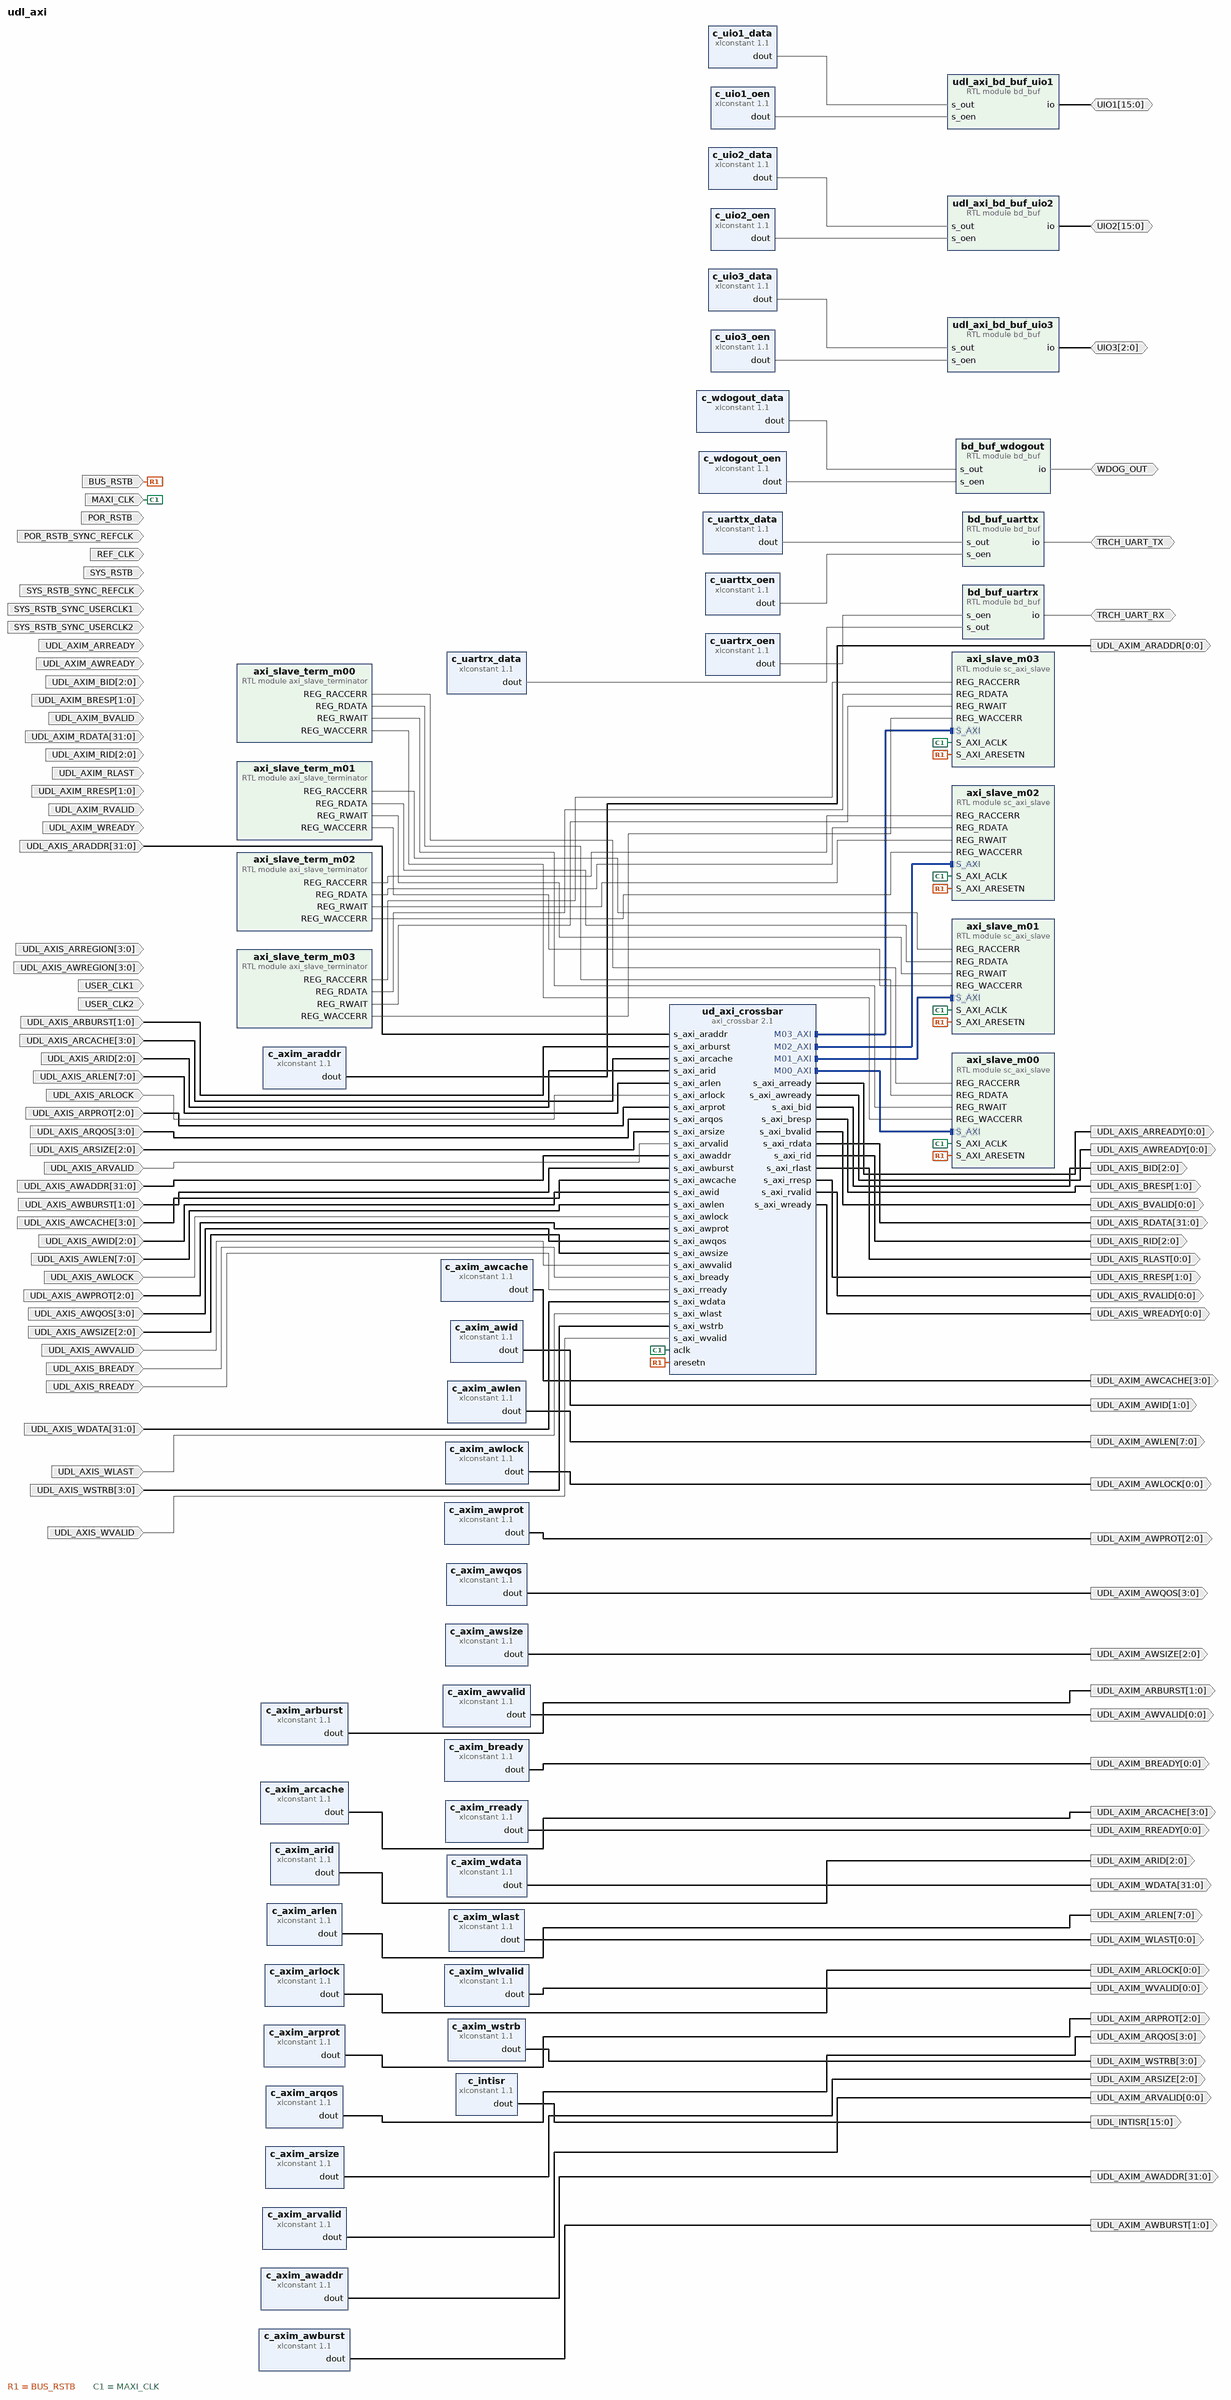
[diagram p0: block diagram of the top level]
# Vivado block design udl_axi, xc7a200tfbg676-1, Vivado 2022.2
create_bd_design udl_axi

create_bd_port -dir I -type clk MAXI_CLK
set_property -dict {CONFIG.FREQ_HZ 48000000} [get_bd_ports MAXI_CLK]
create_bd_port -dir I -type clk REF_CLK
set_property -dict {CONFIG.FREQ_HZ 24000000} [get_bd_ports REF_CLK]
create_bd_port -dir I -type clk USER_CLK2
set_property -dict {CONFIG.FREQ_HZ 24000000} [get_bd_ports USER_CLK2]
create_bd_port -dir I -type rst SYS_RSTB_SYNC_REFCLK
create_bd_port -dir I -type rst SYS_RSTB_SYNC_USERCLK1
create_bd_port -dir I -type rst SYS_RSTB_SYNC_USERCLK2
create_bd_port -dir I -type rst SYS_RSTB
create_bd_port -dir I -type rst POR_RSTB
create_bd_port -dir I -type rst POR_RSTB_SYNC_REFCLK
create_bd_port -dir I -type rst BUS_RSTB
create_bd_port -dir O -from 15 -to 0 -type intr UDL_INTISR
create_bd_port -dir O -from 1 -to 0 -type data UDL_AXIM_AWID
create_bd_port -dir O -from 0 -to 0 -type data UDL_AXIM_AWLOCK
create_bd_port -dir IO -from 15 -to 0 -type data UIO1
create_bd_port -dir O -from 31 -to 0 -type data UDL_AXIM_AWADDR
create_bd_port -dir O -from 7 -to 0 -type data UDL_AXIM_AWLEN
create_bd_port -dir O -from 2 -to 0 -type data UDL_AXIM_AWSIZE
create_bd_port -dir O -from 1 -to 0 -type data UDL_AXIM_AWBURST
create_bd_port -dir O -from 3 -to 0 -type data UDL_AXIM_AWCACHE
create_bd_port -dir O -from 2 -to 0 -type data UDL_AXIM_AWPROT
create_bd_port -dir O -from 3 -to 0 -type data UDL_AXIM_AWQOS
create_bd_port -dir O -from 0 -to 0 -type data UDL_AXIM_AWVALID
create_bd_port -dir I -type data UDL_AXIM_AWREADY
create_bd_port -dir O -from 31 -to 0 -type data UDL_AXIM_WDATA
create_bd_port -dir O -from 3 -to 0 -type data UDL_AXIM_WSTRB
create_bd_port -dir O -from 0 -to 0 -type data UDL_AXIM_WLAST
create_bd_port -dir O -from 0 -to 0 -type data UDL_AXIM_WVALID
create_bd_port -dir I -type data UDL_AXIM_WREADY
create_bd_port -dir I -from 2 -to 0 -type data UDL_AXIM_BID
create_bd_port -dir I -from 1 -to 0 -type data UDL_AXIM_BRESP
create_bd_port -dir I -type data UDL_AXIM_BVALID
create_bd_port -dir O -from 0 -to 0 -type data UDL_AXIM_BREADY
create_bd_port -dir O -from 2 -to 0 -type data UDL_AXIM_ARID
create_bd_port -dir O -from 0 -to 0 -type data UDL_AXIM_ARADDR
create_bd_port -dir O -from 7 -to 0 -type data UDL_AXIM_ARLEN
create_bd_port -dir O -from 2 -to 0 -type data UDL_AXIM_ARSIZE
create_bd_port -dir O -from 1 -to 0 -type data UDL_AXIM_ARBURST
create_bd_port -dir O -from 0 -to 0 -type data UDL_AXIM_ARLOCK
create_bd_port -dir O -from 3 -to 0 -type data UDL_AXIM_ARCACHE
create_bd_port -dir O -from 2 -to 0 -type data UDL_AXIM_ARPROT
create_bd_port -dir O -from 3 -to 0 -type data UDL_AXIM_ARQOS
create_bd_port -dir O -from 0 -to 0 -type data UDL_AXIM_ARVALID
create_bd_port -dir I -type data UDL_AXIM_ARREADY
create_bd_port -dir I -from 2 -to 0 -type data UDL_AXIM_RID
create_bd_port -dir I -from 31 -to 0 -type data UDL_AXIM_RDATA
create_bd_port -dir I -type data UDL_AXIM_RLAST
create_bd_port -dir I -type data UDL_AXIM_RVALID
create_bd_port -dir O -from 0 -to 0 -type data UDL_AXIM_RREADY
create_bd_port -dir I -from 2 -to 0 -type data UDL_AXIS_AWID
create_bd_port -dir I -from 31 -to 0 -type data UDL_AXIS_AWADDR
create_bd_port -dir I -from 7 -to 0 -type data UDL_AXIS_AWLEN
create_bd_port -dir I -from 2 -to 0 -type data UDL_AXIS_AWSIZE
create_bd_port -dir I -from 1 -to 0 -type data UDL_AXIS_AWBURST
create_bd_port -dir I -from 3 -to 0 -type data UDL_AXIS_AWCACHE
create_bd_port -dir I -from 2 -to 0 -type data UDL_AXIS_AWPROT
create_bd_port -dir I -from 3 -to 0 -type data UDL_AXIS_AWREGION
create_bd_port -dir I -from 3 -to 0 -type data UDL_AXIS_AWQOS
create_bd_port -dir I -type data UDL_AXIS_AWVALID
create_bd_port -dir O -from 0 -to 0 -type data UDL_AXIS_AWREADY
create_bd_port -dir I -from 31 -to 0 -type data UDL_AXIS_WDATA
create_bd_port -dir I -from 3 -to 0 -type data UDL_AXIS_WSTRB
create_bd_port -dir I -type data UDL_AXIS_WLAST
create_bd_port -dir I -type data UDL_AXIS_WVALID
create_bd_port -dir O -from 0 -to 0 -type data UDL_AXIS_WREADY
create_bd_port -dir O -from 2 -to 0 -type data UDL_AXIS_BID
create_bd_port -dir O -from 1 -to 0 -type data UDL_AXIS_BRESP
create_bd_port -dir O -from 0 -to 0 -type data UDL_AXIS_BVALID
create_bd_port -dir I -type data UDL_AXIS_BREADY
create_bd_port -dir I -from 2 -to 0 -type data UDL_AXIS_ARID
create_bd_port -dir I -from 31 -to 0 -type data UDL_AXIS_ARADDR
create_bd_port -dir I -from 7 -to 0 -type data UDL_AXIS_ARLEN
create_bd_port -dir I -from 2 -to 0 -type data UDL_AXIS_ARSIZE
create_bd_port -dir I -from 1 -to 0 -type data UDL_AXIS_ARBURST
create_bd_port -dir I -type data UDL_AXIS_ARLOCK
create_bd_port -dir I -from 3 -to 0 -type data UDL_AXIS_ARCACHE
create_bd_port -dir I -from 2 -to 0 -type data UDL_AXIS_ARPROT
create_bd_port -dir I -from 3 -to 0 -type data UDL_AXIS_ARREGION
create_bd_port -dir I -from 3 -to 0 -type data UDL_AXIS_ARQOS
create_bd_port -dir I -type data UDL_AXIS_ARVALID
create_bd_port -dir O -from 0 -to 0 -type data UDL_AXIS_ARREADY
create_bd_port -dir O -from 2 -to 0 -type data UDL_AXIS_RID
create_bd_port -dir O -from 31 -to 0 -type data UDL_AXIS_RDATA
create_bd_port -dir O -from 1 -to 0 -type data UDL_AXIS_RRESP
create_bd_port -dir O -from 0 -to 0 -type data UDL_AXIS_RLAST
create_bd_port -dir O -from 0 -to 0 -type data UDL_AXIS_RVALID
create_bd_port -dir I -type data UDL_AXIS_RREADY
create_bd_port -dir IO -from 15 -to 0 -type data UIO2
create_bd_port -dir IO -from 2 -to 0 -type data UIO3
create_bd_port -dir IO -type data TRCH_UART_TX
create_bd_port -dir IO -type data TRCH_UART_RX
create_bd_port -dir IO -type data WDOG_OUT
create_bd_port -dir I -type clk USER_CLK1
set_property -dict {CONFIG.FREQ_HZ 24000000} [get_bd_ports USER_CLK1]
create_bd_port -dir I -from 1 -to 0 -type data UDL_AXIM_RRESP
create_bd_port -dir I -type data UDL_AXIS_AWLOCK

create_bd_cell -type ip -vlnv xilinx.com:ip:axi_crossbar:2.1 ud_axi_crossbar
set_property -dict [list \
  CONFIG.ID_WIDTH 3 \
  CONFIG.M00_A00_ADDR_WIDTH 16 \
  CONFIG.M00_A00_BASE_ADDR 0x0000000050000000 \
  CONFIG.M01_A00_ADDR_WIDTH 16 \
  CONFIG.M01_A00_BASE_ADDR 0x0000000050010000 \
  CONFIG.M02_A00_ADDR_WIDTH 16 \
  CONFIG.M02_A00_BASE_ADDR 0x0000000050020000 \
  CONFIG.M03_A00_ADDR_WIDTH 16 \
  CONFIG.M03_A00_BASE_ADDR 0x0000000050030000 \
  CONFIG.NUM_MI 4 \
  CONFIG.S00_ARB_PRIORITY 0 \
] [get_bd_cells ud_axi_crossbar]
create_bd_cell -type ip -vlnv xilinx.com:ip:xlconstant:1.1 c_uio1_oen
set_property -dict {CONFIG.CONST_VAL 0x0000 CONFIG.CONST_WIDTH 16} [get_bd_cells c_uio1_oen]
create_bd_cell -type ip -vlnv xilinx.com:ip:xlconstant:1.1 c_uio1_data
set_property -dict {CONFIG.CONST_VAL 0x0000 CONFIG.CONST_WIDTH 16} [get_bd_cells c_uio1_data]
create_bd_cell -type ip -vlnv xilinx.com:ip:xlconstant:1.1 c_uio2_oen
set_property -dict {CONFIG.CONST_VAL 0x0000 CONFIG.CONST_WIDTH 16} [get_bd_cells c_uio2_oen]
create_bd_cell -type ip -vlnv xilinx.com:ip:xlconstant:1.1 c_uio2_data
set_property -dict {CONFIG.CONST_VAL 0x0000 CONFIG.CONST_WIDTH 16} [get_bd_cells c_uio2_data]
create_bd_cell -type ip -vlnv xilinx.com:ip:xlconstant:1.1 c_uio3_oen
set_property -dict {CONFIG.CONST_VAL 0x0 CONFIG.CONST_WIDTH 3} [get_bd_cells c_uio3_oen]
create_bd_cell -type ip -vlnv xilinx.com:ip:xlconstant:1.1 c_uio3_data
set_property -dict {CONFIG.CONST_VAL 0x0 CONFIG.CONST_WIDTH 3} [get_bd_cells c_uio3_data]
create_bd_cell -type ip -vlnv xilinx.com:ip:xlconstant:1.1 c_uarttx_oen
create_bd_cell -type ip -vlnv xilinx.com:ip:xlconstant:1.1 c_uarttx_data
create_bd_cell -type ip -vlnv xilinx.com:ip:xlconstant:1.1 c_uartrx_oen
create_bd_cell -type ip -vlnv xilinx.com:ip:xlconstant:1.1 c_uartrx_data
create_bd_cell -type ip -vlnv xilinx.com:ip:xlconstant:1.1 c_wdogout_oen
create_bd_cell -type ip -vlnv xilinx.com:ip:xlconstant:1.1 c_wdogout_data
create_bd_cell -type module -reference sc_axi_slave axi_slave_m01
create_bd_cell -type module -reference sc_axi_slave axi_slave_m02
create_bd_cell -type module -reference sc_axi_slave axi_slave_m03
create_bd_cell -type ip -vlnv xilinx.com:ip:xlconstant:1.1 c_intisr
set_property -dict {CONFIG.CONST_VAL 0x0000 CONFIG.CONST_WIDTH 16} [get_bd_cells c_intisr]
create_bd_cell -type module -reference sc_axi_slave axi_slave_m00
create_bd_cell -type module -reference axi_slave_terminator axi_slave_term_m00
create_bd_cell -type module -reference axi_slave_terminator axi_slave_term_m01
create_bd_cell -type module -reference axi_slave_terminator axi_slave_term_m02
create_bd_cell -type module -reference axi_slave_terminator axi_slave_term_m03
create_bd_cell -type module -reference bd_buf bd_buf_uartrx
set_property -dict {CONFIG.BUS_WIDTH 1} [get_bd_cells bd_buf_uartrx]
create_bd_cell -type module -reference bd_buf bd_buf_uarttx
set_property -dict {CONFIG.BUS_WIDTH 1} [get_bd_cells bd_buf_uarttx]
create_bd_cell -type module -reference bd_buf bd_buf_wdogout
set_property -dict {CONFIG.BUS_WIDTH 1} [get_bd_cells bd_buf_wdogout]
create_bd_cell -type module -reference bd_buf udl_axi_bd_buf_uio1
create_bd_cell -type module -reference bd_buf udl_axi_bd_buf_uio2
create_bd_cell -type module -reference bd_buf udl_axi_bd_buf_uio3
set_property -dict {CONFIG.BUS_WIDTH 3} [get_bd_cells udl_axi_bd_buf_uio3]
create_bd_cell -type ip -vlnv xilinx.com:ip:xlconstant:1.1 c_axim_awid
set_property -dict {CONFIG.CONST_VAL 0b00 CONFIG.CONST_WIDTH 2} [get_bd_cells c_axim_awid]
create_bd_cell -type ip -vlnv xilinx.com:ip:xlconstant:1.1 c_axim_awaddr
set_property -dict {CONFIG.CONST_VAL 0x00000000 CONFIG.CONST_WIDTH 32} [get_bd_cells c_axim_awaddr]
create_bd_cell -type ip -vlnv xilinx.com:ip:xlconstant:1.1 c_axim_awlen
set_property -dict {CONFIG.CONST_VAL 0x00 CONFIG.CONST_WIDTH 8} [get_bd_cells c_axim_awlen]
create_bd_cell -type ip -vlnv xilinx.com:ip:xlconstant:1.1 c_axim_awsize
set_property -dict {CONFIG.CONST_VAL 0x0 CONFIG.CONST_WIDTH 3} [get_bd_cells c_axim_awsize]
create_bd_cell -type ip -vlnv xilinx.com:ip:xlconstant:1.1 c_axim_awburst
set_property -dict {CONFIG.CONST_VAL 0b00 CONFIG.CONST_WIDTH 2} [get_bd_cells c_axim_awburst]
create_bd_cell -type ip -vlnv xilinx.com:ip:xlconstant:1.1 c_axim_awlock
set_property -dict {CONFIG.CONST_VAL 0} [get_bd_cells c_axim_awlock]
create_bd_cell -type ip -vlnv xilinx.com:ip:xlconstant:1.1 c_axim_awcache
set_property -dict {CONFIG.CONST_VAL 0x0 CONFIG.CONST_WIDTH 4} [get_bd_cells c_axim_awcache]
create_bd_cell -type ip -vlnv xilinx.com:ip:xlconstant:1.1 c_axim_awprot
set_property -dict {CONFIG.CONST_VAL 0x0 CONFIG.CONST_WIDTH 3} [get_bd_cells c_axim_awprot]
create_bd_cell -type ip -vlnv xilinx.com:ip:xlconstant:1.1 c_axim_awqos
set_property -dict {CONFIG.CONST_VAL 0x0 CONFIG.CONST_WIDTH 4} [get_bd_cells c_axim_awqos]
create_bd_cell -type ip -vlnv xilinx.com:ip:xlconstant:1.1 c_axim_awvalid
set_property -dict {CONFIG.CONST_VAL 0} [get_bd_cells c_axim_awvalid]
create_bd_cell -type ip -vlnv xilinx.com:ip:xlconstant:1.1 c_axim_wdata
set_property -dict {CONFIG.CONST_VAL 0x00000000 CONFIG.CONST_WIDTH 32} [get_bd_cells c_axim_wdata]
create_bd_cell -type ip -vlnv xilinx.com:ip:xlconstant:1.1 c_axim_wstrb
set_property -dict {CONFIG.CONST_VAL 0x0 CONFIG.CONST_WIDTH 4} [get_bd_cells c_axim_wstrb]
create_bd_cell -type ip -vlnv xilinx.com:ip:xlconstant:1.1 c_axim_wlast
set_property -dict {CONFIG.CONST_VAL 0} [get_bd_cells c_axim_wlast]
create_bd_cell -type ip -vlnv xilinx.com:ip:xlconstant:1.1 c_axim_wlvalid
create_bd_cell -type ip -vlnv xilinx.com:ip:xlconstant:1.1 c_axim_bready
create_bd_cell -type ip -vlnv xilinx.com:ip:xlconstant:1.1 c_axim_arid
set_property -dict {CONFIG.CONST_VAL 0x0 CONFIG.CONST_WIDTH 3} [get_bd_cells c_axim_arid]
create_bd_cell -type ip -vlnv xilinx.com:ip:xlconstant:1.1 c_axim_araddr
create_bd_cell -type ip -vlnv xilinx.com:ip:xlconstant:1.1 c_axim_arlen
set_property -dict {CONFIG.CONST_VAL 0x00 CONFIG.CONST_WIDTH 8} [get_bd_cells c_axim_arlen]
create_bd_cell -type ip -vlnv xilinx.com:ip:xlconstant:1.1 c_axim_arsize
set_property -dict {CONFIG.CONST_VAL 0x0 CONFIG.CONST_WIDTH 3} [get_bd_cells c_axim_arsize]
create_bd_cell -type ip -vlnv xilinx.com:ip:xlconstant:1.1 c_axim_arburst
set_property -dict {CONFIG.CONST_VAL 0b00 CONFIG.CONST_WIDTH 2} [get_bd_cells c_axim_arburst]
create_bd_cell -type ip -vlnv xilinx.com:ip:xlconstant:1.1 c_axim_arlock
set_property -dict {CONFIG.CONST_VAL 0} [get_bd_cells c_axim_arlock]
create_bd_cell -type ip -vlnv xilinx.com:ip:xlconstant:1.1 c_axim_arcache
set_property -dict {CONFIG.CONST_VAL 0x0 CONFIG.CONST_WIDTH 4} [get_bd_cells c_axim_arcache]
create_bd_cell -type ip -vlnv xilinx.com:ip:xlconstant:1.1 c_axim_arqos
set_property -dict {CONFIG.CONST_VAL 0x0 CONFIG.CONST_WIDTH 4} [get_bd_cells c_axim_arqos]
create_bd_cell -type ip -vlnv xilinx.com:ip:xlconstant:1.1 c_axim_arprot
set_property -dict {CONFIG.CONST_VAL 0x0 CONFIG.CONST_WIDTH 3} [get_bd_cells c_axim_arprot]
create_bd_cell -type ip -vlnv xilinx.com:ip:xlconstant:1.1 c_axim_arvalid
set_property -dict {CONFIG.CONST_VAL 0} [get_bd_cells c_axim_arvalid]
create_bd_cell -type ip -vlnv xilinx.com:ip:xlconstant:1.1 c_axim_rready

# ---- connections ----

connect_bd_intf_net [get_bd_intf_pins axi_slave_m00/S_AXI] [get_bd_intf_pins ud_axi_crossbar/M00_AXI]
connect_bd_intf_net [get_bd_intf_pins axi_slave_m01/S_AXI] [get_bd_intf_pins ud_axi_crossbar/M01_AXI]
connect_bd_intf_net [get_bd_intf_pins axi_slave_m02/S_AXI] [get_bd_intf_pins ud_axi_crossbar/M02_AXI]
connect_bd_intf_net [get_bd_intf_pins axi_slave_m03/S_AXI] [get_bd_intf_pins ud_axi_crossbar/M03_AXI]
connect_bd_net [get_bd_ports BUS_RSTB] \
  [get_bd_pins ud_axi_crossbar/aresetn] [get_bd_pins axi_slave_m00/S_AXI_ARESETN] [get_bd_pins axi_slave_m01/S_AXI_ARESETN] \
  [get_bd_pins axi_slave_m02/S_AXI_ARESETN] [get_bd_pins axi_slave_m03/S_AXI_ARESETN]
connect_bd_net [get_bd_ports MAXI_CLK] \
  [get_bd_pins ud_axi_crossbar/aclk] [get_bd_pins axi_slave_m00/S_AXI_ACLK] [get_bd_pins axi_slave_m01/S_AXI_ACLK] \
  [get_bd_pins axi_slave_m02/S_AXI_ACLK] [get_bd_pins axi_slave_m03/S_AXI_ACLK]
connect_bd_net [get_bd_ports UIO1] [get_bd_pins udl_axi_bd_buf_uio1/io]
connect_bd_net [get_bd_ports UIO2] [get_bd_pins udl_axi_bd_buf_uio2/io]
connect_bd_net [get_bd_ports UIO3] [get_bd_pins udl_axi_bd_buf_uio3/io]
connect_bd_net [get_bd_ports TRCH_UART_TX] [get_bd_pins bd_buf_uarttx/io]
connect_bd_net [get_bd_ports TRCH_UART_RX] [get_bd_pins bd_buf_uartrx/io]
connect_bd_net [get_bd_ports WDOG_OUT] [get_bd_pins bd_buf_wdogout/io]
connect_bd_net [get_bd_ports UDL_AXIS_ARADDR] [get_bd_pins ud_axi_crossbar/s_axi_araddr]
connect_bd_net [get_bd_ports UDL_AXIS_ARBURST] [get_bd_pins ud_axi_crossbar/s_axi_arburst]
connect_bd_net [get_bd_ports UDL_AXIS_ARCACHE] [get_bd_pins ud_axi_crossbar/s_axi_arcache]
connect_bd_net [get_bd_ports UDL_AXIS_ARID] [get_bd_pins ud_axi_crossbar/s_axi_arid]
connect_bd_net [get_bd_ports UDL_AXIS_ARLEN] [get_bd_pins ud_axi_crossbar/s_axi_arlen]
connect_bd_net [get_bd_ports UDL_AXIS_ARLOCK] [get_bd_pins ud_axi_crossbar/s_axi_arlock]
connect_bd_net [get_bd_ports UDL_AXIS_ARPROT] [get_bd_pins ud_axi_crossbar/s_axi_arprot]
connect_bd_net [get_bd_ports UDL_AXIS_ARQOS] [get_bd_pins ud_axi_crossbar/s_axi_arqos]
connect_bd_net [get_bd_ports UDL_AXIS_ARSIZE] [get_bd_pins ud_axi_crossbar/s_axi_arsize]
connect_bd_net [get_bd_ports UDL_AXIS_ARVALID] [get_bd_pins ud_axi_crossbar/s_axi_arvalid]
connect_bd_net [get_bd_ports UDL_AXIS_AWADDR] [get_bd_pins ud_axi_crossbar/s_axi_awaddr]
connect_bd_net [get_bd_ports UDL_AXIS_AWBURST] [get_bd_pins ud_axi_crossbar/s_axi_awburst]
connect_bd_net [get_bd_ports UDL_AXIS_AWCACHE] [get_bd_pins ud_axi_crossbar/s_axi_awcache]
connect_bd_net [get_bd_ports UDL_AXIS_AWID] [get_bd_pins ud_axi_crossbar/s_axi_awid]
connect_bd_net [get_bd_ports UDL_AXIS_AWLEN] [get_bd_pins ud_axi_crossbar/s_axi_awlen]
connect_bd_net [get_bd_ports UDL_AXIS_AWLOCK] [get_bd_pins ud_axi_crossbar/s_axi_awlock]
connect_bd_net [get_bd_ports UDL_AXIS_AWPROT] [get_bd_pins ud_axi_crossbar/s_axi_awprot]
connect_bd_net [get_bd_ports UDL_AXIS_AWQOS] [get_bd_pins ud_axi_crossbar/s_axi_awqos]
connect_bd_net [get_bd_ports UDL_AXIS_AWSIZE] [get_bd_pins ud_axi_crossbar/s_axi_awsize]
connect_bd_net [get_bd_ports UDL_AXIS_AWVALID] [get_bd_pins ud_axi_crossbar/s_axi_awvalid]
connect_bd_net [get_bd_ports UDL_AXIS_BREADY] [get_bd_pins ud_axi_crossbar/s_axi_bready]
connect_bd_net [get_bd_ports UDL_AXIS_RREADY] [get_bd_pins ud_axi_crossbar/s_axi_rready]
connect_bd_net [get_bd_ports UDL_AXIS_WDATA] [get_bd_pins ud_axi_crossbar/s_axi_wdata]
connect_bd_net [get_bd_ports UDL_AXIS_WLAST] [get_bd_pins ud_axi_crossbar/s_axi_wlast]
connect_bd_net [get_bd_ports UDL_AXIS_WSTRB] [get_bd_pins ud_axi_crossbar/s_axi_wstrb]
connect_bd_net [get_bd_ports UDL_AXIS_WVALID] [get_bd_pins ud_axi_crossbar/s_axi_wvalid]
connect_bd_net -net axi_crossbar_s_axi_arready [get_bd_pins ud_axi_crossbar/s_axi_arready] [get_bd_ports UDL_AXIS_ARREADY]
connect_bd_net -net axi_crossbar_s_axi_awready [get_bd_pins ud_axi_crossbar/s_axi_awready] [get_bd_ports UDL_AXIS_AWREADY]
connect_bd_net -net axi_crossbar_s_axi_bid [get_bd_pins ud_axi_crossbar/s_axi_bid] [get_bd_ports UDL_AXIS_BID]
connect_bd_net -net axi_crossbar_s_axi_bresp [get_bd_pins ud_axi_crossbar/s_axi_bresp] [get_bd_ports UDL_AXIS_BRESP]
connect_bd_net -net axi_crossbar_s_axi_bvalid [get_bd_pins ud_axi_crossbar/s_axi_bvalid] [get_bd_ports UDL_AXIS_BVALID]
connect_bd_net -net axi_crossbar_s_axi_rdata [get_bd_pins ud_axi_crossbar/s_axi_rdata] [get_bd_ports UDL_AXIS_RDATA]
connect_bd_net -net axi_crossbar_s_axi_rid [get_bd_pins ud_axi_crossbar/s_axi_rid] [get_bd_ports UDL_AXIS_RID]
connect_bd_net -net axi_crossbar_s_axi_rlast [get_bd_pins ud_axi_crossbar/s_axi_rlast] [get_bd_ports UDL_AXIS_RLAST]
connect_bd_net -net axi_crossbar_s_axi_rresp [get_bd_pins ud_axi_crossbar/s_axi_rresp] [get_bd_ports UDL_AXIS_RRESP]
connect_bd_net -net axi_crossbar_s_axi_rvalid [get_bd_pins ud_axi_crossbar/s_axi_rvalid] [get_bd_ports UDL_AXIS_RVALID]
connect_bd_net -net axi_crossbar_s_axi_wready [get_bd_pins ud_axi_crossbar/s_axi_wready] [get_bd_ports UDL_AXIS_WREADY]
connect_bd_net [get_bd_pins axi_slave_term_m00/REG_RACCERR] [get_bd_pins axi_slave_m00/REG_RACCERR]
connect_bd_net [get_bd_pins axi_slave_term_m00/REG_RDATA] [get_bd_pins axi_slave_m00/REG_RDATA]
connect_bd_net [get_bd_pins axi_slave_term_m00/REG_RWAIT] [get_bd_pins axi_slave_m00/REG_RWAIT]
connect_bd_net [get_bd_pins axi_slave_term_m00/REG_WACCERR] [get_bd_pins axi_slave_m00/REG_WACCERR]
connect_bd_net [get_bd_pins axi_slave_term_m01/REG_RACCERR] [get_bd_pins axi_slave_m01/REG_RACCERR]
connect_bd_net [get_bd_pins axi_slave_term_m01/REG_RDATA] [get_bd_pins axi_slave_m01/REG_RDATA]
connect_bd_net [get_bd_pins axi_slave_term_m01/REG_RWAIT] [get_bd_pins axi_slave_m01/REG_RWAIT]
connect_bd_net [get_bd_pins axi_slave_term_m01/REG_WACCERR] [get_bd_pins axi_slave_m01/REG_WACCERR]
connect_bd_net [get_bd_pins axi_slave_term_m02/REG_RACCERR] [get_bd_pins axi_slave_m02/REG_RACCERR]
connect_bd_net [get_bd_pins axi_slave_term_m02/REG_RDATA] [get_bd_pins axi_slave_m02/REG_RDATA]
connect_bd_net [get_bd_pins axi_slave_term_m02/REG_RWAIT] [get_bd_pins axi_slave_m02/REG_RWAIT]
connect_bd_net [get_bd_pins axi_slave_term_m02/REG_WACCERR] [get_bd_pins axi_slave_m02/REG_WACCERR]
connect_bd_net [get_bd_pins axi_slave_term_m03/REG_RACCERR] [get_bd_pins axi_slave_m03/REG_RACCERR]
connect_bd_net [get_bd_pins axi_slave_term_m03/REG_RDATA] [get_bd_pins axi_slave_m03/REG_RDATA]
connect_bd_net [get_bd_pins axi_slave_term_m03/REG_RWAIT] [get_bd_pins axi_slave_m03/REG_RWAIT]
connect_bd_net [get_bd_pins axi_slave_term_m03/REG_WACCERR] [get_bd_pins axi_slave_m03/REG_WACCERR]
connect_bd_net [get_bd_pins c_axim_araddr/dout] [get_bd_ports UDL_AXIM_ARADDR]
connect_bd_net [get_bd_pins c_axim_arburst/dout] [get_bd_ports UDL_AXIM_ARBURST]
connect_bd_net [get_bd_pins c_axim_arcache/dout] [get_bd_ports UDL_AXIM_ARCACHE]
connect_bd_net [get_bd_pins c_axim_arid/dout] [get_bd_ports UDL_AXIM_ARID]
connect_bd_net [get_bd_pins c_axim_arlen/dout] [get_bd_ports UDL_AXIM_ARLEN]
connect_bd_net [get_bd_pins c_axim_arlock/dout] [get_bd_ports UDL_AXIM_ARLOCK]
connect_bd_net [get_bd_pins c_axim_arprot/dout] [get_bd_ports UDL_AXIM_ARPROT]
connect_bd_net [get_bd_pins c_axim_arqos/dout] [get_bd_ports UDL_AXIM_ARQOS]
connect_bd_net [get_bd_pins c_axim_arsize/dout] [get_bd_ports UDL_AXIM_ARSIZE]
connect_bd_net [get_bd_pins c_axim_arvalid/dout] [get_bd_ports UDL_AXIM_ARVALID]
connect_bd_net [get_bd_pins c_axim_awaddr/dout] [get_bd_ports UDL_AXIM_AWADDR]
connect_bd_net [get_bd_pins c_axim_awburst/dout] [get_bd_ports UDL_AXIM_AWBURST]
connect_bd_net [get_bd_pins c_axim_awcache/dout] [get_bd_ports UDL_AXIM_AWCACHE]
connect_bd_net [get_bd_pins c_axim_awid/dout] [get_bd_ports UDL_AXIM_AWID]
connect_bd_net [get_bd_pins c_axim_awlen/dout] [get_bd_ports UDL_AXIM_AWLEN]
connect_bd_net [get_bd_pins c_axim_awlock/dout] [get_bd_ports UDL_AXIM_AWLOCK]
connect_bd_net [get_bd_pins c_axim_awprot/dout] [get_bd_ports UDL_AXIM_AWPROT]
connect_bd_net [get_bd_pins c_axim_awqos/dout] [get_bd_ports UDL_AXIM_AWQOS]
connect_bd_net [get_bd_pins c_axim_awsize/dout] [get_bd_ports UDL_AXIM_AWSIZE]
connect_bd_net [get_bd_pins c_axim_awvalid/dout] [get_bd_ports UDL_AXIM_AWVALID]
connect_bd_net [get_bd_pins c_axim_bready/dout] [get_bd_ports UDL_AXIM_BREADY]
connect_bd_net [get_bd_pins c_axim_rready/dout] [get_bd_ports UDL_AXIM_RREADY]
connect_bd_net [get_bd_pins c_axim_wdata/dout] [get_bd_ports UDL_AXIM_WDATA]
connect_bd_net [get_bd_pins c_axim_wlast/dout] [get_bd_ports UDL_AXIM_WLAST]
connect_bd_net [get_bd_pins c_axim_wlvalid/dout] [get_bd_ports UDL_AXIM_WVALID]
connect_bd_net [get_bd_pins c_axim_wstrb/dout] [get_bd_ports UDL_AXIM_WSTRB]
connect_bd_net [get_bd_pins c_intisr/dout] [get_bd_ports UDL_INTISR]
connect_bd_net [get_bd_pins c_uartrx_data/dout] [get_bd_pins bd_buf_uartrx/s_out]
connect_bd_net [get_bd_pins c_uartrx_oen/dout] [get_bd_pins bd_buf_uartrx/s_oen]
connect_bd_net [get_bd_pins c_uarttx_data/dout] [get_bd_pins bd_buf_uarttx/s_out]
connect_bd_net [get_bd_pins c_uarttx_oen/dout] [get_bd_pins bd_buf_uarttx/s_oen]
connect_bd_net [get_bd_pins c_uio1_data/dout] [get_bd_pins udl_axi_bd_buf_uio1/s_out]
connect_bd_net [get_bd_pins c_uio1_oen/dout] [get_bd_pins udl_axi_bd_buf_uio1/s_oen]
connect_bd_net [get_bd_pins c_uio2_data/dout] [get_bd_pins udl_axi_bd_buf_uio2/s_out]
connect_bd_net [get_bd_pins c_uio2_oen/dout] [get_bd_pins udl_axi_bd_buf_uio2/s_oen]
connect_bd_net [get_bd_pins c_uio3_data/dout] [get_bd_pins udl_axi_bd_buf_uio3/s_out]
connect_bd_net [get_bd_pins c_uio3_oen/dout] [get_bd_pins udl_axi_bd_buf_uio3/s_oen]
connect_bd_net [get_bd_pins c_wdogout_data/dout] [get_bd_pins bd_buf_wdogout/s_out]
connect_bd_net [get_bd_pins c_wdogout_oen/dout] [get_bd_pins bd_buf_wdogout/s_oen]

validate_bd_design
save_bd_design
